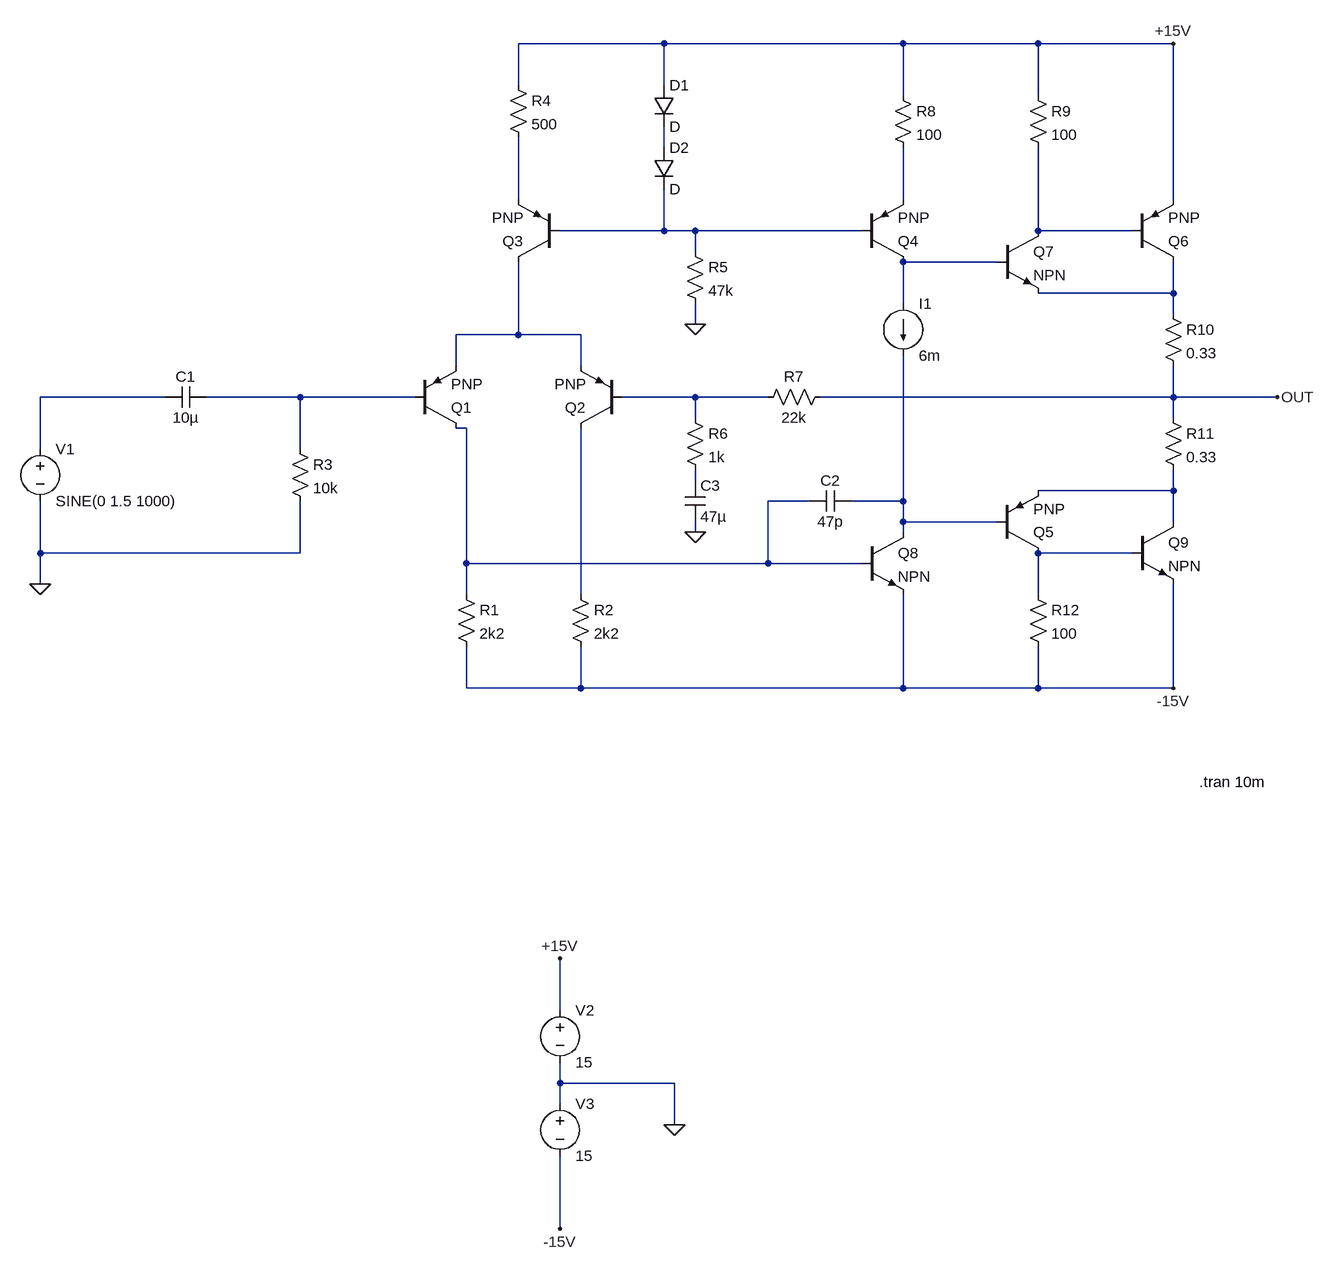
[diagram p0: schematic Draft2.asc]
Draft2.asc, the LTspice schematic file:
Version 4
SHEET 1 1436 1612
WIRE 432 -304 208 -304
WIRE 800 -304 432 -304
WIRE 1008 -304 800 -304
WIRE 1216 -304 1008 -304
WIRE 208 -240 208 -304
WIRE 432 -240 432 -304
WIRE 800 -224 800 -304
WIRE 1008 -224 1008 -304
WIRE 432 -144 432 -176
WIRE 208 -64 208 -160
WIRE 800 -64 800 -144
WIRE 1216 -64 1216 -304
WIRE 432 -16 432 -80
WIRE 432 -16 272 -16
WIRE 480 -16 432 -16
WIRE 736 -16 480 -16
WIRE 1008 -16 1008 -144
WIRE 1152 -16 1008 -16
WIRE 480 16 480 -16
WIRE 944 32 800 32
WIRE 1216 80 1216 32
WIRE 1216 80 1008 80
WIRE 800 96 800 32
WIRE 1216 112 1216 80
WIRE 480 128 480 96
WIRE 208 144 208 32
WIRE 208 144 112 144
WIRE 304 144 208 144
WIRE 112 192 112 144
WIRE 304 192 304 144
WIRE -336 240 -528 240
WIRE -128 240 -272 240
WIRE 48 240 -128 240
WIRE 480 240 368 240
WIRE 592 240 480 240
WIRE 1216 240 1216 192
WIRE 1216 240 672 240
WIRE 1376 240 1216 240
WIRE 480 272 480 240
WIRE 1216 272 1216 240
WIRE 128 288 112 288
WIRE -528 320 -528 240
WIRE -128 320 -128 240
WIRE 480 368 480 352
WIRE 1216 384 1216 352
WIRE 1216 384 1008 384
WIRE 656 400 592 400
WIRE 800 400 800 176
WIRE 800 400 720 400
WIRE 800 432 800 400
WIRE 944 432 800 432
WIRE 1216 432 1216 384
WIRE 480 448 480 432
WIRE 800 448 800 432
WIRE -528 480 -528 400
WIRE -128 480 -128 400
WIRE -128 480 -528 480
WIRE 1152 480 1008 480
WIRE 128 496 128 288
WIRE 592 496 592 400
WIRE 592 496 128 496
WIRE 736 496 592 496
WIRE -528 528 -528 480
WIRE 128 544 128 496
WIRE 304 544 304 288
WIRE 1008 544 1008 480
WIRE 128 688 128 624
WIRE 304 688 304 624
WIRE 304 688 128 688
WIRE 800 688 800 544
WIRE 800 688 304 688
WIRE 1008 688 1008 624
WIRE 1008 688 800 688
WIRE 1216 688 1216 528
WIRE 1216 688 1008 688
WIRE 272 1184 272 1104
WIRE 272 1296 272 1264
WIRE 448 1296 272 1296
WIRE 272 1328 272 1296
WIRE 448 1360 448 1296
WIRE 272 1520 272 1408
FLAG 272 1104 +15V
FLAG 1216 -304 +15V
FLAG 272 1520 -15V
FLAG 1216 688 -15V
FLAG -528 528 0
FLAG 448 1360 0
FLAG 480 128 0
FLAG 480 448 0
FLAG 1376 240 OUT
SYMBOL pnp 48 288 M180
SYMATTR InstName Q1
SYMBOL pnp 368 288 R180
SYMATTR InstName Q2
SYMBOL pnp 272 32 R180
SYMATTR InstName Q3
SYMBOL voltage -528 304 R0
SYMATTR InstName V1
SYMATTR Value SINE(0 1.5 1000)
SYMBOL voltage 272 1168 R0
SYMATTR InstName V2
SYMATTR Value 15
SYMBOL voltage 272 1312 R0
SYMATTR InstName V3
SYMATTR Value 15
SYMBOL res 112 528 R0
SYMATTR InstName R1
SYMATTR Value 2k2
SYMBOL res 288 528 R0
SYMATTR InstName R2
SYMATTR Value 2k2
SYMBOL diode 416 -240 R0
SYMATTR InstName D1
SYMBOL diode 416 -144 R0
SYMATTR InstName D2
SYMBOL cap -272 224 R90
WINDOW 0 0 32 VBottom 2
WINDOW 3 32 32 VTop 2
SYMATTR InstName C1
SYMATTR Value 10µ
SYMBOL res -144 304 R0
SYMATTR InstName R3
SYMATTR Value 10k
SYMBOL pnp 736 32 M180
SYMATTR InstName Q4
SYMBOL pnp 944 480 M180
SYMATTR InstName Q5
SYMBOL pnp 1152 32 M180
SYMATTR InstName Q6
SYMBOL res 192 -256 R0
SYMATTR InstName R4
SYMATTR Value 500
SYMBOL res 464 0 R0
SYMATTR InstName R5
SYMATTR Value 47k
SYMBOL res 464 256 R0
SYMATTR InstName R6
SYMATTR Value 1k
SYMBOL res 576 256 R270
WINDOW 0 32 56 VTop 2
WINDOW 3 0 56 VBottom 2
SYMATTR InstName R7
SYMATTR Value 22k
SYMBOL npn 944 -16 R0
SYMATTR InstName Q7
SYMBOL npn 736 448 R0
SYMATTR InstName Q8
SYMBOL npn 1152 432 R0
SYMATTR InstName Q9
SYMBOL res 784 -240 R0
SYMATTR InstName R8
SYMATTR Value 100
SYMBOL res 992 -240 R0
SYMATTR InstName R9
SYMATTR Value 100
SYMBOL res 1200 96 R0
SYMATTR InstName R10
SYMATTR Value 0.33
SYMBOL res 1200 256 R0
SYMATTR InstName R11
SYMATTR Value 0.33
SYMBOL cap 720 384 R90
WINDOW 0 0 32 VBottom 2
WINDOW 3 32 32 VTop 2
SYMATTR InstName C2
SYMATTR Value 47p
SYMBOL cap 464 368 R0
SYMATTR InstName C3
SYMATTR Value 47µ
SYMBOL res 992 528 R0
SYMATTR InstName R12
SYMATTR Value 100
SYMBOL current 800 96 R0
SYMATTR InstName I1
SYMATTR Value 6m
TEXT 1256 832 Left 2 !.tran 10m

The netlist it stands for:
* Draft2.asc
Q1 N012 N010 N008 0 PNP
Q2 N017 N011 N008 0 PNP
Q3 N008 N004 N002 0 PNP
V1 N009 0 SINE(0 1.5 1000)
V2 +15V 0 15
V3 0 -15V 15
R1 N012 -15V 2k2
R2 N017 -15V 2k2
D1 +15V N001 D
D2 N001 N004 D
C1 N010 N009 10µ
R3 N010 0 10k
Q4 N006 N004 N003 0 PNP
Q5 N016 N015 N014 0 PNP
Q6 N007 N005 +15V 0 PNP
R4 +15V N002 500
R5 N004 0 47k
R6 N011 N013 1k
R7 N011 OUT 22k
Q7 N005 N006 N007 0 NPN
Q8 N015 N012 -15V 0 NPN
Q9 N014 N016 -15V 0 NPN
R8 +15V N003 100
R9 +15V N005 100
R10 N007 OUT 0.33
R11 OUT N014 0.33
C2 N015 N012 47p
C3 N013 0 47µ
R12 N016 -15V 100
I1 N006 N015 6m
.model D D
.lib standard.dio
.model NPN NPN
.model PNP PNP
.lib standard.bjt
.tran 10m
.backanno
.end